# Altium schematic sheet Top.SchDoc
size B; SheetNumber: 1; SheetTotal: 8
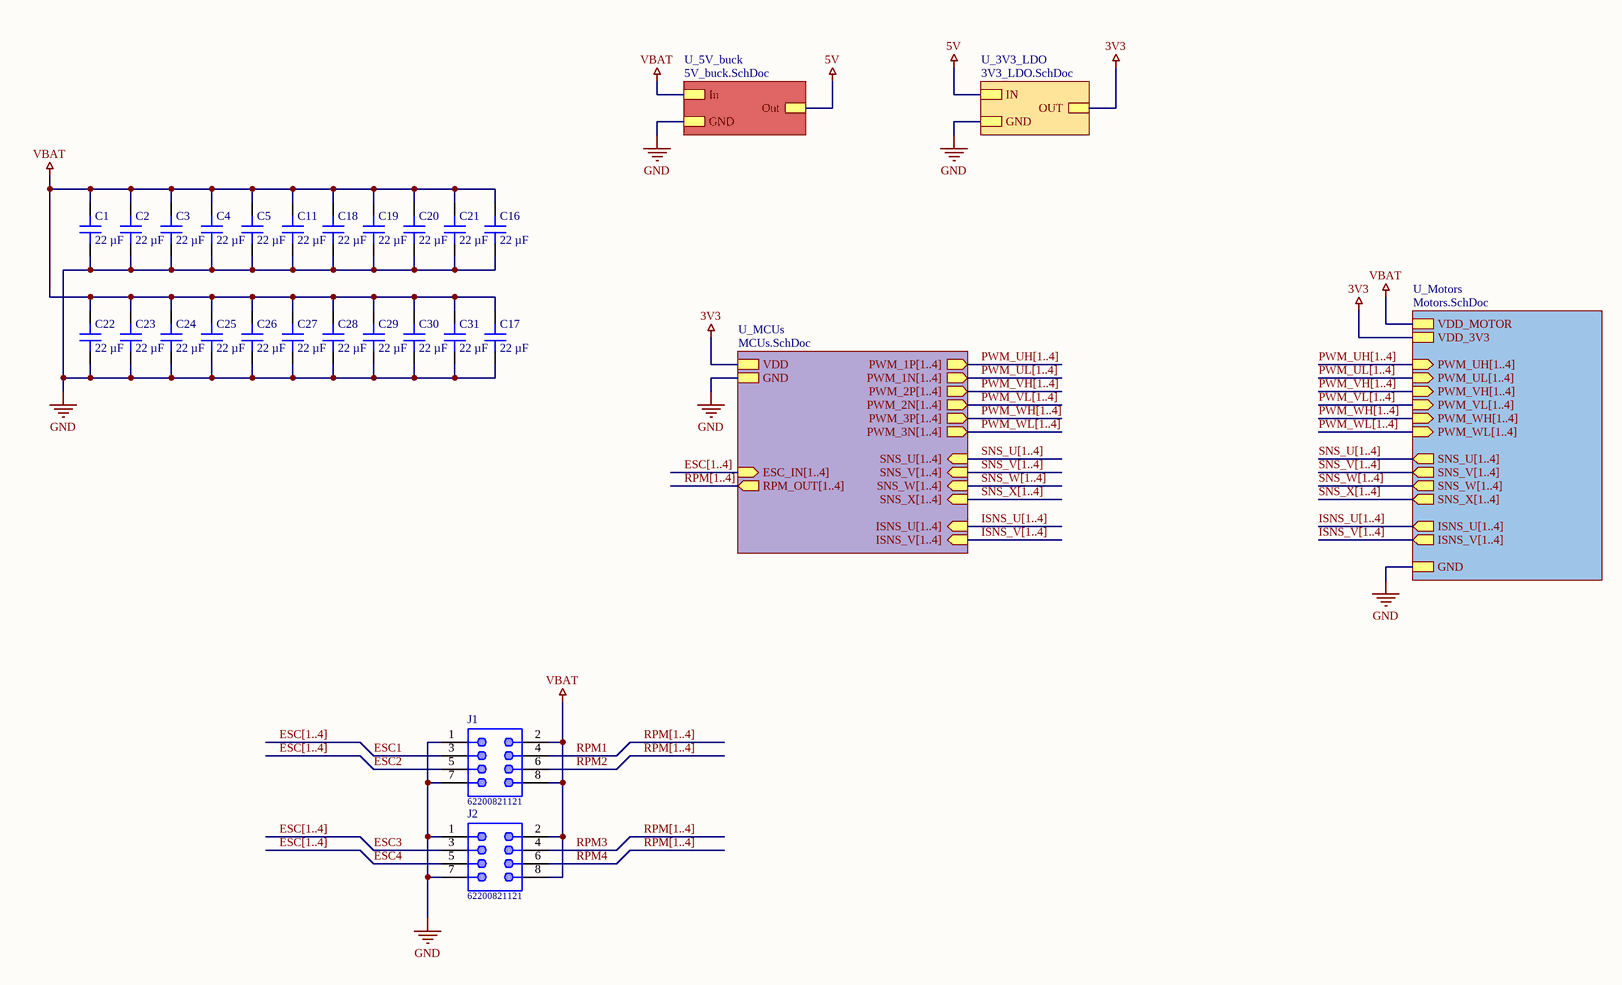
[diagram p0: Top.SchDoc]

## Parts
C1  22 µF  [CAP 0805_2012]
C2  22 µF  [CAP 0805_2012]
C3  22 µF  [CAP 0805_2012]
C4  22 µF  [CAP 0805_2012]
C5  22 µF  [CAP 0805_2012]
C11  22 µF  [CAP 0805_2012]
C16  22 µF  [CAP 0805_2012]
C17  22 µF  [CAP 0805_2012]
C18  22 µF  [CAP 0805_2012]
C19  22 µF  [CAP 0805_2012]
C20  22 µF  [CAP 0805_2012]
C21  22 µF  [CAP 0805_2012]
C22  22 µF  [CAP 0805_2012]
C23  22 µF  [CAP 0805_2012]
C24  22 µF  [CAP 0805_2012]
C25  22 µF  [CAP 0805_2012]
C26  22 µF  [CAP 0805_2012]
C27  22 µF  [CAP 0805_2012]
C28  22 µF  [CAP 0805_2012]
C29  22 µF  [CAP 0805_2012]
C30  22 µF  [CAP 0805_2012]
C31  22 µF  [CAP 0805_2012]
J1  62200821121  [62200821121]
J2  62200821121  [62200821121]

## Sub-sheets
U_3V3_LDO = 3V3_LDO.SchDoc: OUT, IN, GND
U_5V_buck = 5V_buck.SchDoc: Out, In, GND
U_MCUs = MCUs.SchDoc: VDD, GND, PWM_1P[1..4] (out), PWM_1N[1..4] (out), PWM_2P[1..4] (out), PWM_2N[1..4] (out), PWM_3P[1..4] (out), PWM_3N[1..4] (out), SNS_U[1..4] (in), SNS_V[1..4] (in), SNS_W[1..4] (in), SNS_X[1..4] (in), ISNS_U[1..4] (in), ISNS_V[1..4] (in), ESC_IN[1..4] (in), RPM_OUT[1..4] (out)
U_Motors = Motors.SchDoc: VDD_MOTOR, GND, PWM_UH[1..4] (in), PWM_UL[1..4] (in), PWM_VH[1..4] (in), PWM_VL[1..4] (in), PWM_WH[1..4] (in), PWM_WL[1..4] (in), SNS_U[1..4] (out), SNS_V[1..4] (out), SNS_W[1..4] (out), SNS_X[1..4] (out), VDD_3V3, ISNS_U[1..4] (out), ISNS_V[1..4] (out)

## Nets
3V3: sheet U_3V3_LDO/OUT, sheet U_Motors/VDD_3V3, sheet U_MCUs/VDD
5V: sheet U_5V_buck/Out, sheet U_3V3_LDO/IN
GND: C1.1 C2.1 C3.1 C4.1 C5.1 C11.1 C16.1 C17.1 C18.1 C19.1 C20.1 C21.1 C22.1 C23.1 C24.1 C25.1 C26.1 C27.1 C28.1 C29.1 C30.1 C31.1 J1.1 J1.7 J2.1 J2.7 ; sheet U_5V_buck/GND, sheet U_3V3_LDO/GND, sheet U_Motors/GND, sheet U_MCUs/GND
VBAT: C1.2 C2.2 C3.2 C4.2 C5.2 C11.2 C16.2 C17.2 C18.2 C19.2 C20.2 C21.2 C22.2 C23.2 C24.2 C25.2 C26.2 C27.2 C28.2 C29.2 C30.2 C31.2 J1.2 J1.8 J2.2 J2.8 ; sheet U_5V_buck/In, sheet U_Motors/VDD_MOTOR
ESC1: J1.3
ESC2: J1.5
ESC3: J2.3
ESC4: J2.5
RPM1: J1.4
RPM2: J1.6
RPM3: J2.4
RPM4: J2.6

## Buses and harness runs
bus ESC[1..4]
bus ESC[1..4] = sheet U_MCUs/ESC_IN[1..4]
bus ISNS_U[1..4] = sheet U_MCUs/ISNS_U[1..4]
bus ISNS_U[1..4] = sheet U_Motors/ISNS_U[1..4]
bus ISNS_V[1..4] = sheet U_MCUs/ISNS_V[1..4]
bus ISNS_V[1..4] = sheet U_Motors/ISNS_V[1..4]
bus PWM_UH[1..4] = sheet U_MCUs/PWM_1P[1..4]
bus PWM_UH[1..4] = sheet U_Motors/PWM_UH[1..4]
bus PWM_UL[1..4] = sheet U_MCUs/PWM_1N[1..4]
bus PWM_UL[1..4] = sheet U_Motors/PWM_UL[1..4]
bus PWM_VH[1..4] = sheet U_MCUs/PWM_2P[1..4]
bus PWM_VH[1..4] = sheet U_Motors/PWM_VH[1..4]
bus PWM_VL[1..4] = sheet U_MCUs/PWM_2N[1..4]
bus PWM_VL[1..4] = sheet U_Motors/PWM_VL[1..4]
bus PWM_WH[1..4] = sheet U_MCUs/PWM_3P[1..4]
bus PWM_WH[1..4] = sheet U_Motors/PWM_WH[1..4]
bus PWM_WL[1..4] = sheet U_MCUs/PWM_3N[1..4]
bus PWM_WL[1..4] = sheet U_Motors/PWM_WL[1..4]
bus RPM[1..4]
bus RPM[1..4] = sheet U_MCUs/RPM_OUT[1..4]
bus SNS_U[1..4] = sheet U_MCUs/SNS_U[1..4]
bus SNS_U[1..4] = sheet U_Motors/SNS_U[1..4]
bus SNS_V[1..4] = sheet U_MCUs/SNS_V[1..4]
bus SNS_V[1..4] = sheet U_Motors/SNS_V[1..4]
bus SNS_W[1..4] = sheet U_MCUs/SNS_W[1..4]
bus SNS_W[1..4] = sheet U_Motors/SNS_W[1..4]
bus SNS_X[1..4] = sheet U_MCUs/SNS_X[1..4]
bus SNS_X[1..4] = sheet U_Motors/SNS_X[1..4]

## Library data of the parts
C1-C5 C11 C16-C31 = CC0805MKX5R8BB226: CAP CER 22UF 25V X5R 0805; manufacturer: Yageo; Tolerance: ±20%; Part Number: CC0805MKX5R8BB226; Value: 22 µF; Applications: General Purpose; Capacitance: 22 µF; componentlink1description: Datasheet; componentlink1url: https://www.yageo.com/upload/media/product/productsearch/datasheet/mlcc/UPY-GPHC_X5R_4V-to-50V_25.pdf; componentlink2description: DigiKey Link; componentlink2url: https://www.digikey.com/en/products/detail/yageo/CC0805MKX5R8BB226/5195309; Device Package: 0805 (2012 Metric); Lifecycle Status: Active; Minimum Order: 1; Mounting Type: Surface Mount, MLCC; Operating Temperature: -55°C ~ 85°C; Package / Case: 0805 (2012 Metric); packaging: TapeAndReel; partid: 39226; Part Status: Active; price: 0.10; series: CC; Size / Dimension: 0.079" L x 0.049" W (2.00mm x 1.25mm); Supplier 1: DigiKey; Supplier Part Number 1: 311-1903-1-ND; Temperature Coefficient: X5R; Thickness (Max): 0.057" (1.45mm); Voltage - Rated: 25V
  C1-C5 C11 C16-C19 C21-C31: lastupdated: 8/21/2022 8:03:23 PM
  C20: lastupdated: 8/25/2022 6:52:09 AM
J1 J2 = 62200821121: WR-PHD Pin Header, THT, pitch 1.27mm, Dual Row, Vertical, 8p; Manufacturer: Wurth Elektronik; Pin Number: 8; Rated Current: 1A; Working Voltage: 100VAC; Withstanding Voltage: 500VAC; Contact Resistance: 20mOhm; System: Connector; ComponentLink1Description: Manufacturer; ComponentLink1URL: http://www.we-online.de; ComponentLink2Description: Datasheet; ComponentLink2URL: https://www.we-online.com/catalog/datasheet/62200821121.pdf; Manufacturer Part Number: 62200821121; Published Date: May 2020; Pitch: 1.27mm; Operating Temperature: -40 to +105degC; Mounting Technology: THT; Packaging: Box; Gender: Pin Header; Row Number: Dual; Orientation: Vertical